# Altium schematic sheet power.SchDoc
size A4
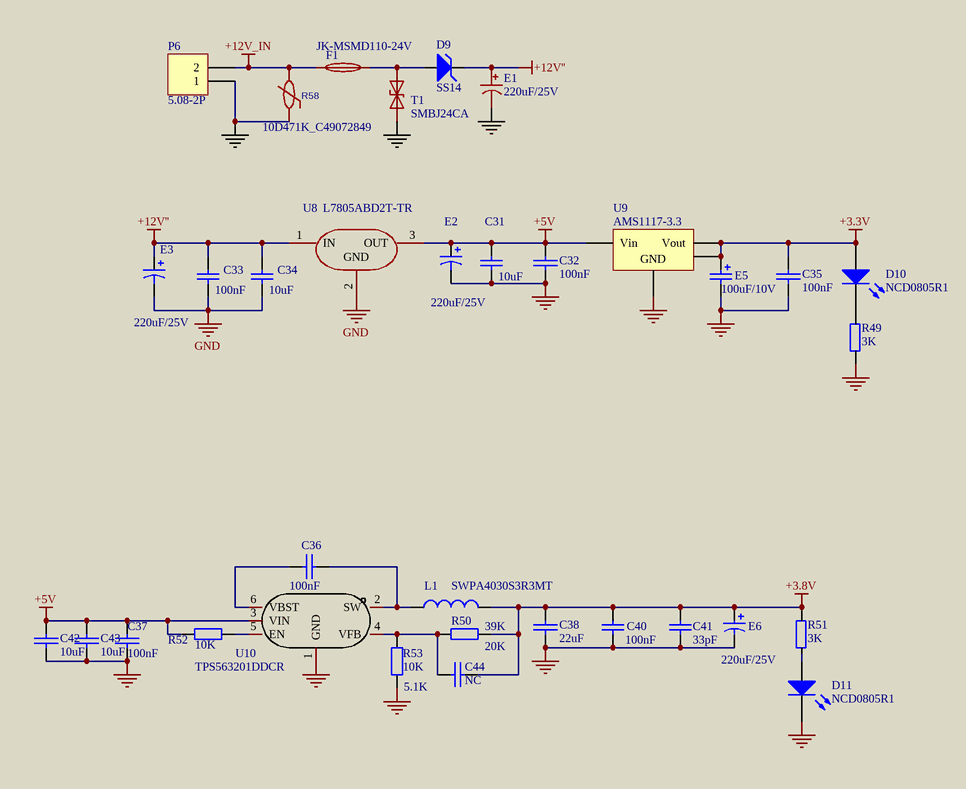
[diagram p0: power.SchDoc]

## Parts
C31  10uF  [LC-0805_C]
C32  100nF  [LC-0805_C]
C33  100nF  [LC-0805_C]
C34  10uF  [LC-0805_C]
C35  100nF  [LC-0805_C]
C36  100nF  [LC-0805_C]
C37  100nF  [LC-0805_C]
C38  22uF  [LC-1206_C]
C40  100nF  [LC-0805_C]
C41  33pF  [LC-0805_C]
C42  10uF  [LC-1206_C]
C43  10uF  [LC-1206_C]
C44  NC  [LC-0805_C]
D9  SS14  [LC-SMA(DO-214AC)_S5]
D10  NCD0805R1  [LC-0805_LED_S1]
D11  NCD0805R1  [LC-0805_LED_S1]
E1  220uF/25V  [CAP-TH_BD6.3-P2.50]
E2  220uF/25V  [CAP-TH_BD6.3-P2.50]
E3  220uF/25V  [CAP-TH_BD6.3-P2.50]
E5  100uF/10V  [3528_B]
E6  220uF/25V  [CAP-TH_BD6.3-P2.50]
F1  JK-MSMD110-24V  [F1812]
L1  SWPA4030S3R3MT  [LC-4.0*4.0]
P6  5.08-2P  [MKDSN_2RMI]
R49  3K  [LC-0805_R]
R50  39K  [LC-0805_R]
R51  3K  [LC-0805_R]
R52  10K  [LC-0805_R]
R53  10K  [LC-0805_R]
R58  10D471K_C49072849  [RES-TH_L11.0-W6.0-P7.50]
T1  SMBJ24CA  [SMB_L4.6-W3.6-LS5.3-BI]
U8  L7805ABD2T-TR  [LC-TO-263-2]
U9  AMS1117-3.3  [LC-SOT-223]
U10  TPS563201DDCR  [LC-SOT-23-6]

## Nets
+3.3V: C35.1 D10.1(A) E5.1 U9.3(Vout) U9.4(Vout)
+3.8V: C38.1 C40.1 C41.1 C44.1 E6.1 L1.2 R50.1 R51.1
+5V: C31.1 C32.1 C37.2 C42.1 C43.1 E2.1 R52.1 U8.3(OUT) U9.1(Vin) U10.3(VIN)
+12V'': C33.1 C34.1 D9.2(K) E1.1 E3.1 U8.1(IN)
+12V_IN: F1.1 P6.2 R58.2
GND: C31.2 C32.2 C33.2 C34.2 C35.2 C37.1 C38.2 C40.2 C41.2 C42.2 C43.2 D11.2(K) E1.2 E2.2 E3.2 E5.2 E6.2 P6.1 R49.2 R53.1 R58.1 T1.1(K) U8.2(GND) U9.2(GND) U10.1(GND)
NetC36_1: C36.1 U10.6(VBST)
NetC36_2: C36.2 L1.1 U10.2(SW)
NetC44_2: C44.2 R50.2 R53.2 U10.4(VFB)
NetD9_1: D9.1(A) F1.2 T1.2(A)
NetD10_2: D10.2(K) R49.1
NetD11_1: D11.1(A) R51.2
NetR52_2: R52.2 U10.5(EN)

## Notes on the sheet
- (near R50) 20K
- (near R53) 5.1K

## Library data of the parts
C31 C33 C34 = Cap: Capacitor; Value: 104; Published: 8-Jun-2000; LatestRevisionDate: 17-Jul-2002; LatestRevisionNote: Re-released for DXP Platform.; Publisher: Altium Limited
C32 C35-C38 C40 C42-C44 = CAP: Capacitor
  C40: Published: 8-Jun-2000; Revision: July-2002: Re-released for DXP Platform.; Publisher: Altium Limited; Value: 100nF
C41 = CAP: Capacitor; Value: 100nF; Published: 8-Jun-2000; Revision: July-2002: Re-released for DXP Platform.; Publisher: Altium Limited
D9 = CONSTANT: constant diode
D10 D11 = LED3: Typical BLUE SiC LED; Published: 8-Jun-2000; LatestRevisionDate: 17-Dec-2003; LatestRevisionNote: PCB Footprint replaced.; DatasheetVersion: 16-Apr-2002; PackageVersion: 16-Apr-2002; PackageReference: 3.5X2.8X1.9; Publisher: Altium Limited; PackageDescription: SM LED; 2 C-Bend Leads; Body 3.5 x 2.8 x 1.9 mm, inc leads (LxWxH typ)
E1 = 35YXJ470M10x16: Manufacturer: rubycon(红宝石); Add into BOM: yes; Value: 470uF; Tolerance: ±20%; Rated Voltage: 35V; φD: 10mm; L: 16mm; Lifetime @ Temp: 10000hrs@105℃; Symbol: 35YXJ470M10x16; Device: 35YXJ470M10x16; LCSC Part Name: 470uF ±20% 35V; Supplier Part: C88732; Manufacturer Part: 35YXJ470M10x16; Supplier Footprint: 插件,D10xL16mm; JLCPCB Part Class: 扩展库; Datasheet: https://atta.szlcsc.com/upload/public/pdf/source/20190927/C432444_D90212164DBC1B856ABE912664018FD4.pdf; Supplier: LCSC; Convert to PCB: yes; Lead Spacing: 5mm
E2 E3 = Cap Pol1: Polarized Capacitor (Radial); Published: 8-Jun-2000; LatestRevisionDate: 17-Jul-2002; LatestRevisionNote: Re-released for DXP Platform.; PackageReference: RB7.6-15; Publisher: Altium Limited
E5 = Cap Pol1: Polarized Capacitor (Radial); Value: 10uF; Published: 8-Jun-2000; Revision: July-2002: Re-released for DXP Platform.; Publisher: Altium Limited
E6 = CAP2: Bi-Polar Capacitor; Value: 470uF/10V
F1 = JK-MSMD110-24V: Manufacturer: JK(金科); Add into BOM: yes; Voltage - Max: 24V; Current - Max: 100A; Hold Current: 1.1A; Trip Current: 2.2A; Resistance - Initial (Ri) (Min): 50mΩ; Resistance - Post Trip (R1) (Max): 250mΩ; Time to Trip(Max): 300ms; Symbol: JK-MSMD110-24V; Device: JK-MSMD110-24V; LCSC Part Name: 24V 1.1A 1812自恢复; Supplier Part: C369172; Manufacturer Part: JK-MSMD110-24V; Supplier Footprint: 1812; JLCPCB Part Class: 扩展库; Datasheet: https://item.szlcsc.com/datasheet/JK-MSMD110-24V/343085.html; Supplier: LCSC; Convert to PCB: yes; Operating Temperature: -40℃~+85℃; Length: 4.73mm; Width: 3.41mm; Height: 1.3mm; Pitch: -
L1 = Inductor: Code_IEC: 1005; Value: 10mH; Published: 8-Jun-2000; LatestRevisionDate: 29-May-2009; LatestRevisionNote: IPC-7351 Footprint Added.; PackageReference: 0402-A; Publisher: Altium Limited; PackageDescription: Chip Inductor; Code_JEITA: 0402
P6 = Header 2: Header, 2-Pin; LatestRevisionDate: 17-Jul-2002; LatestRevisionNote: Re-released for DXP Platform.; Publisher: Altium Limited
R49 R51 = R
R50 R52 R53 = Res2: Resistor; Value: 1K; Published: 8-Jun-2000; LatestRevisionDate: 17-Jul-2002; LatestRevisionNote: Re-released for DXP Platform.; PackageReference: AXIAL-0.4; Publisher: Altium Limited; PackageDescription: Axial Device, Thru-Hole; 2 Leads; 0.4 in Pin Spacing
R58 = 14D471K_C49069733: Symbol: 14D471K_C49069733
T1 = SMBJ24CA_C78416: Manufacturer: Brightking(君耀电子); Add into BOM: yes; Reverse Stand-Off Voltage (Vrwm): 24V; Maximum Clamping Voltage: 38.9V; Peak Pulse Current (Ipp): 15.5A; Breakdown Voltage: 26.7V; Type: TVS; Symbol: SMBJ24CA_C78416; Device: SMBJ24CA_C78416; LCSC Part Name: 24V截止 15.5A峰值脉冲; Supplier Part: C78416; Manufacturer Part: SMBJ24CA; Supplier Footprint: SMB(DO-214AA); JLCPCB Part Class: 扩展库; Datasheet: https://atta.szlcsc.com/upload/public/pdf/source/20181127/C309995_EB3DFB9F9AEE5D2146ECD9FA5992A402.pdf; Supplier: LCSC; Convert to PCB: yes
U8 = L7805CV-DG: Manufacturer: ST(意法半导体); Add into BOM: yes; Output Type: 固定; Maximum Input Voltage: 35V; Output Voltage: 5V; Output Current: 1.5A; Power Supply Rejection Ratio (PSRR): 62dB@(120Hz); Dropout Voltage: 2V@(1A); standby current: 8mA; Output Polarity: 正极; Number of Outputs: 1; Symbol: L7805CV-DG; Device: L7805CV-DG; LCSC Part Name: 正稳压器IC; Supplier Part: C3795; Manufacturer Part: L7805CV-DG; Supplier Footprint: TO-220; JLCPCB Part Class: Extended Part; Datasheet: https://atta.szlcsc.com/upload/public/pdf/source/20140724/1457707163191.pdf; Supplier: LCSC; Convert to PCB: yes; Feature: 短路保护；热保护(TSD)；过流保护(OCP); Operating Temperature: 0℃~+125℃
U9 = Volt Reg: Voltage Regulator; pin to pad: 1>3 2>1 3>4 4>2; Published: 24-Mar-1999; LatestRevisionDate: 17-Jul-2002; LatestRevisionNote: Re-released for DXP Platform.; Publisher: Altium Limited; Code_JEDEC: SMD-220
U10 = TPS563201DDCR: Manufacturer: TI(德州仪器); Add into BOM: yes; Function: 降压型; Synchronous Rectification: 是; Output Type: 可调; Number of Outputs: 1; Topology: 降压式; Input Voltage: 4.5V~17V; Output Voltage: 768mV~7V; Output Current (Max): 3A; Switching Frequency: 580kHz; Name: TPS563201DDCR; Symbol: TPS563201DDCR; Device: TPS563201DDCR; LCSC Part Name: 降压型 Vin=4.5V~17V Vout=768mV~7V 3A; Supplier Part: C116592; Manufacturer Part: TPS563201DDCR; Supplier Footprint: SOT-23-Thin-6; JLCPCB Part Class: Extended Part; Datasheet: https://atta.szlcsc.com/upload/public/pdf/source/20170707/1499421477081.pdf; Supplier: LCSC; Convert to PCB: yes; Operating Temperature: -40℃~+125℃@(TJ)